# Altium schematic sheet Capture_v0.SchDoc
size A1
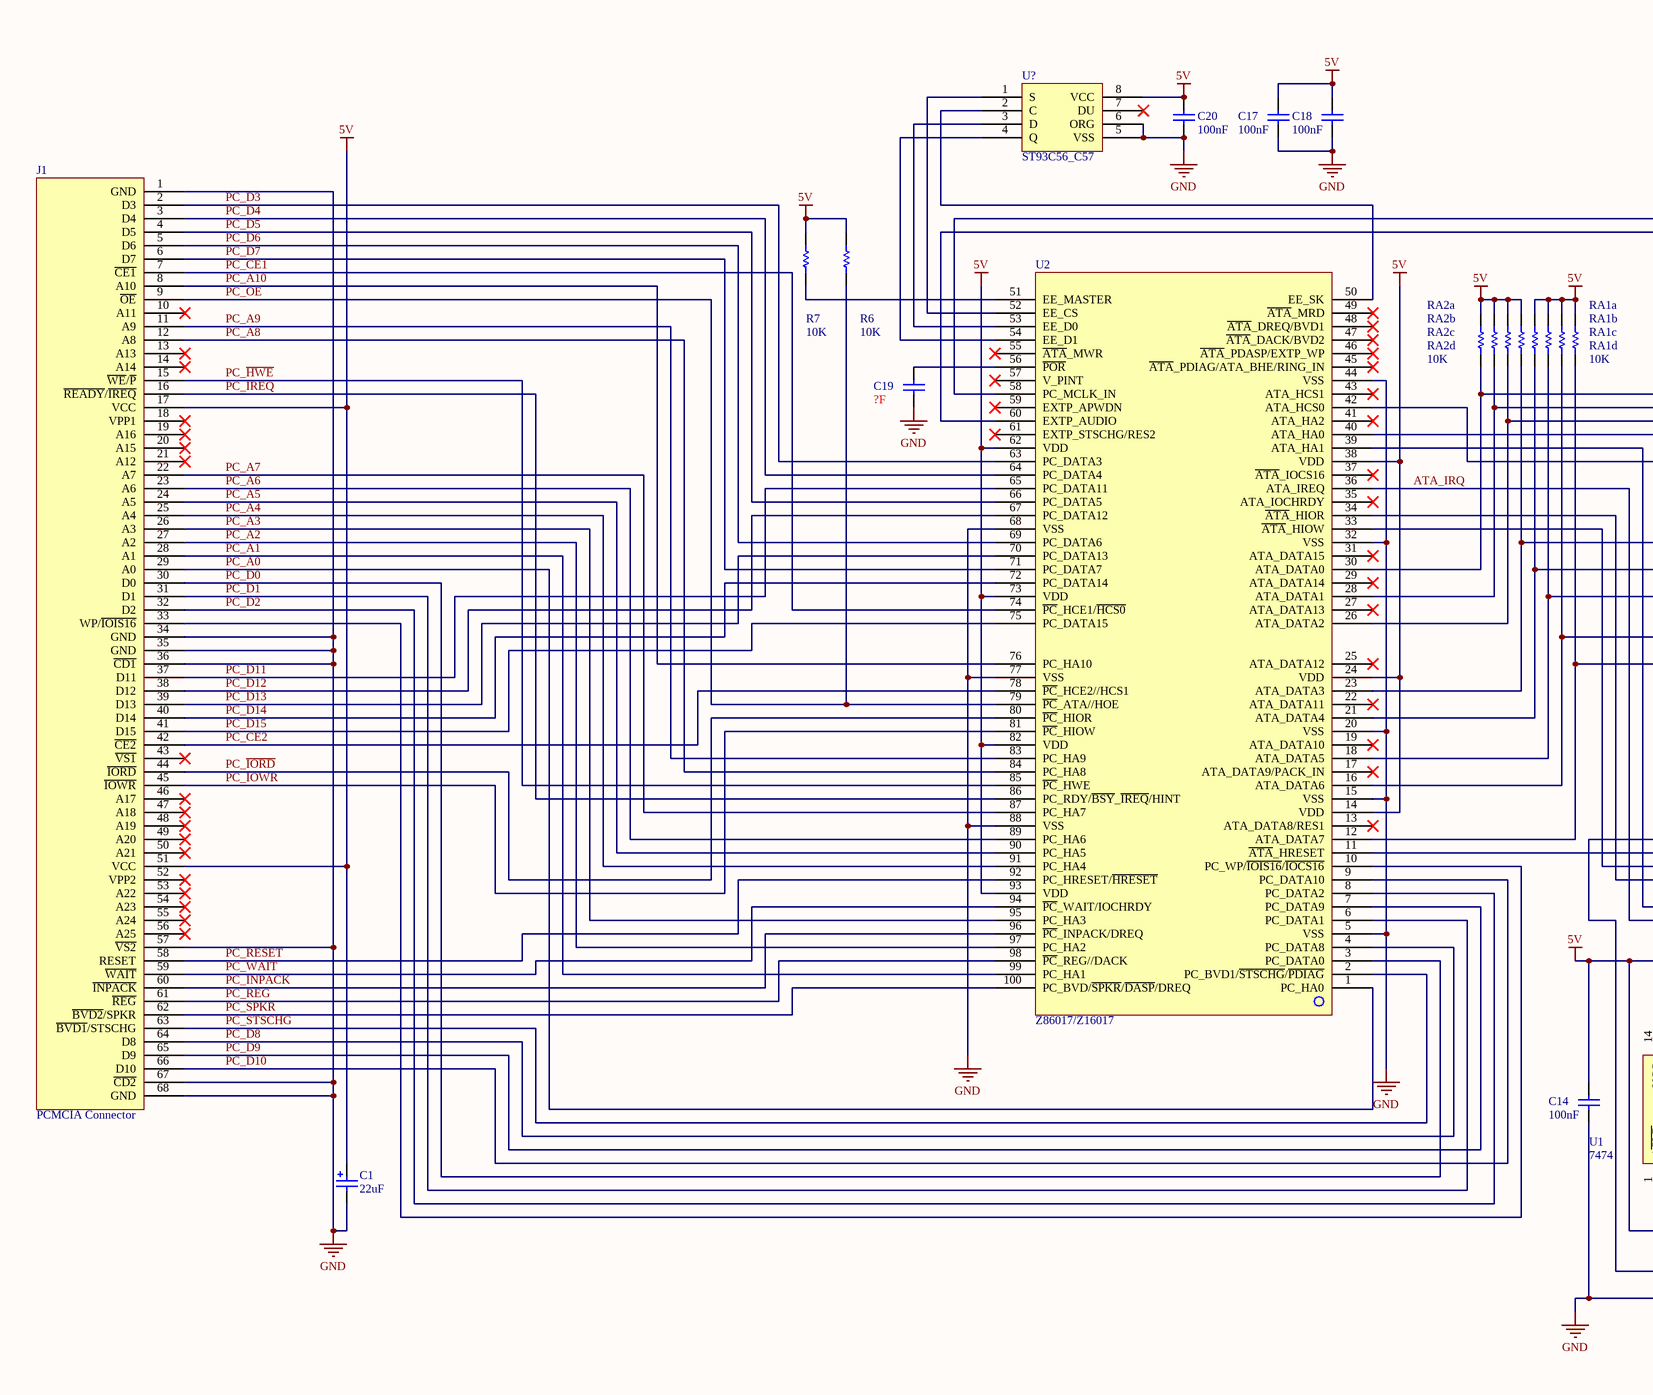
[diagram p0: Capture_v0.SchDoc, left]
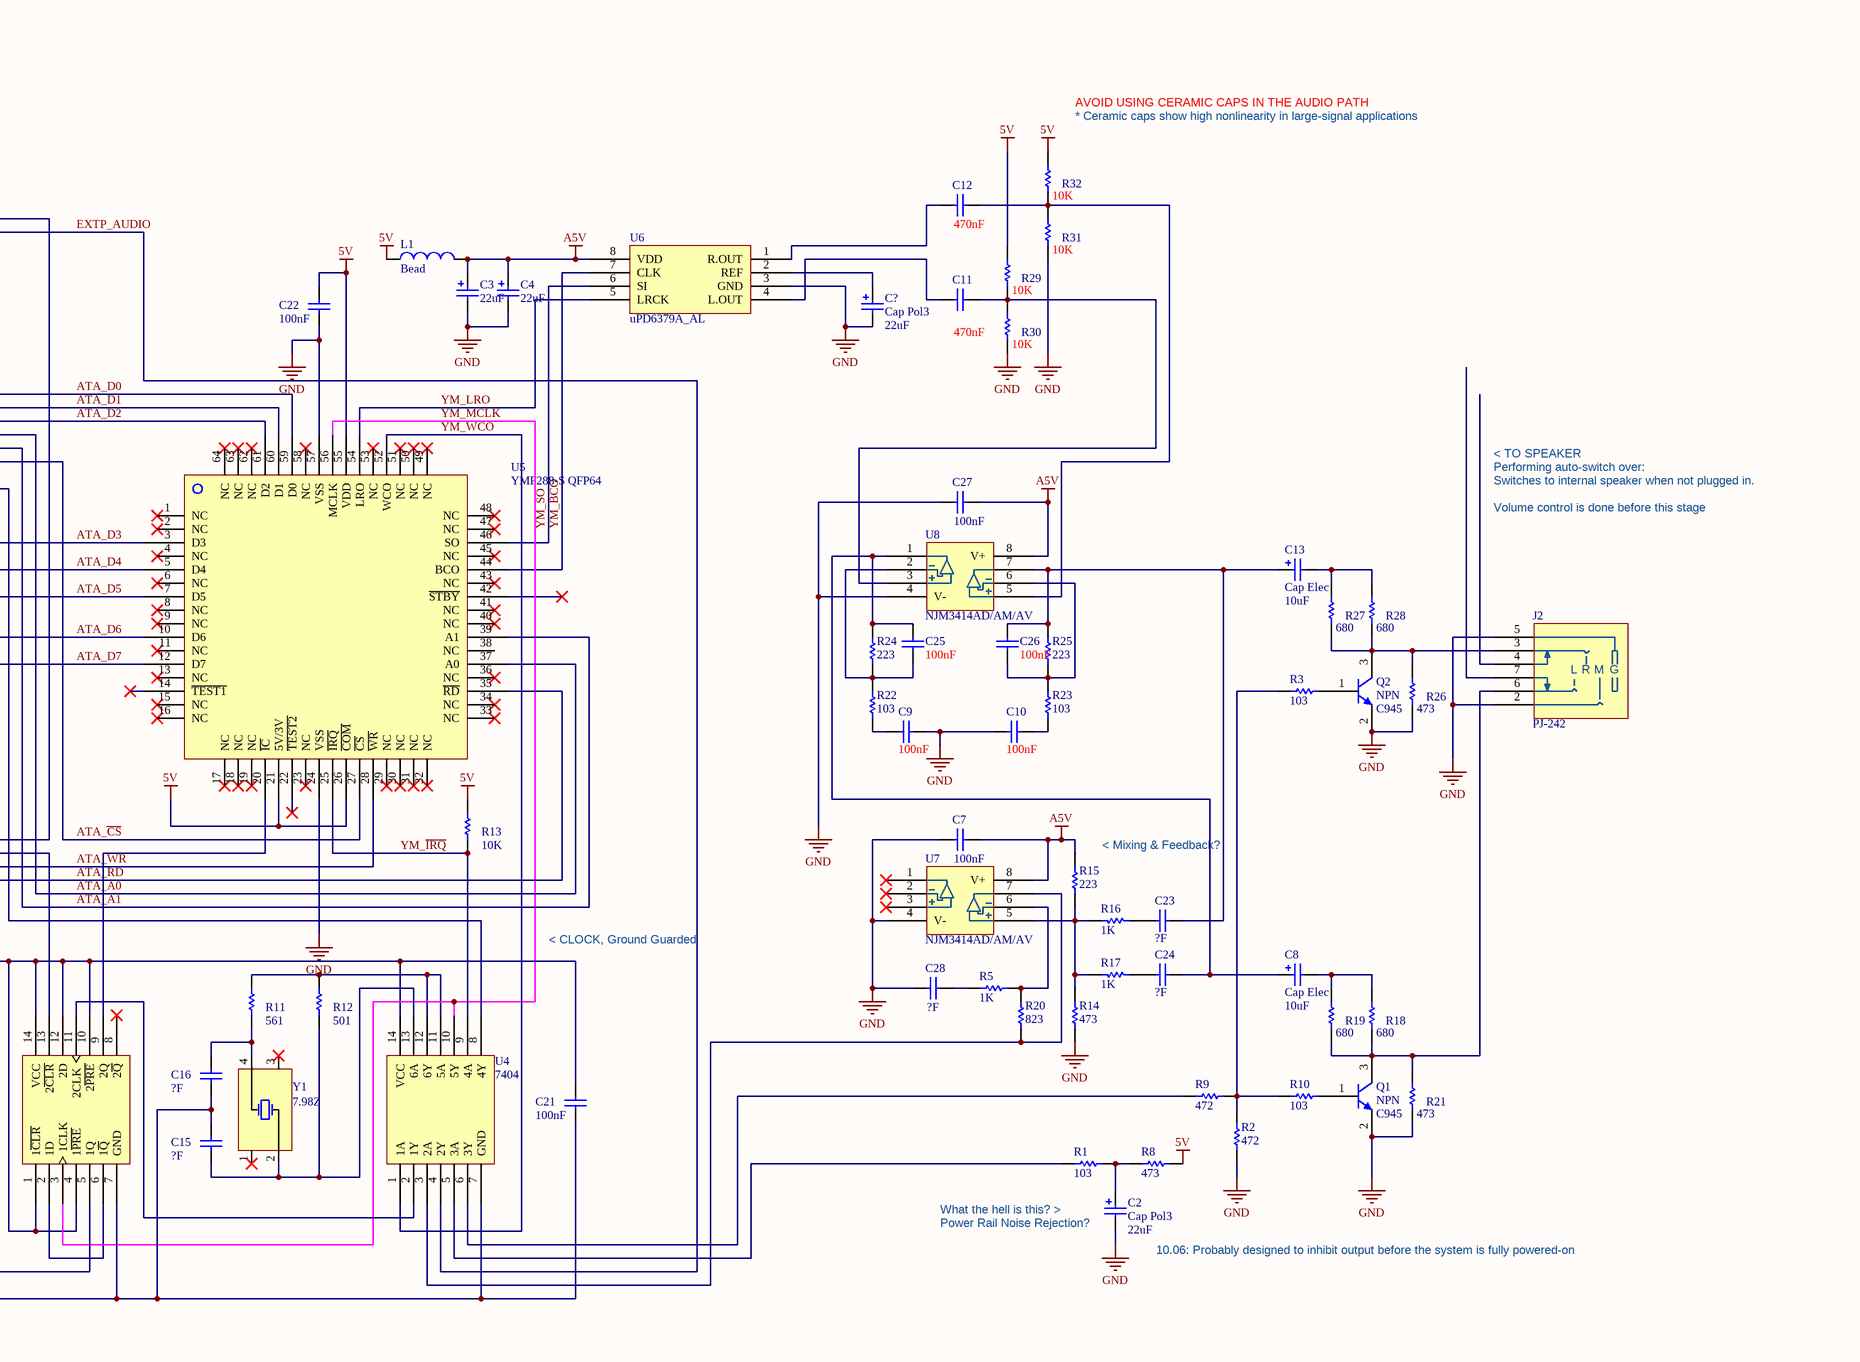
[diagram p1: Capture_v0.SchDoc, right]

## Parts
C1  value 22uF  [C2225]  (hidden comment: Cap Pol3)
C2  Cap Pol3  value 22uF  [C2225]
C3  value 22uF  [C2225]  (hidden comment: Cap Pol3)
C4  value 22uF  [C2225]  (hidden comment: Cap Pol3)
C7  value 100nF  [CEIA0603X04N]  (hidden comment: Cap)
C8  Cap Elec  value 10uF  [C-RB-4_5MM_Cutout]
C9  value 100nF  [CEIA0603X04N]  (hidden comment: Cap)
C10  value 100nF  [CEIA0603X04N]  (hidden comment: Cap)
C11  value 470nF  [CEIA0603X04N]  (hidden comment: Cap)
C12  value 470nF  [CEIA0603X04N]  (hidden comment: Cap)
C13  Cap Elec  value 10uF  [C-RB-4_5MM_Cutout]
C14  value 100nF  [CEIA0603X04N]  (hidden comment: Cap)
C15  value ?F  [CEIA0603X04N]  (hidden comment: Cap)
C16  value ?F  [CEIA0603X04N]  (hidden comment: Cap)
C17  value 100nF  [CEIA0603X04N]  (hidden comment: Cap)
C18  value 100nF  [CEIA0603X04N]  (hidden comment: Cap)
C19  value ?F  [CEIA0603X04N]  (hidden comment: Cap)
C20  value 100nF  [CEIA0603X04N]  (hidden comment: Cap)
C21  value 100nF  [CEIA0603X04N]  (hidden comment: Cap)
C22  value 100nF  [CEIA0603X04N]  (hidden comment: Cap)
C23  value ?F  [CEIA0603X04N]  (hidden comment: Cap)
C24  value ?F  [CEIA0603X04N]  (hidden comment: Cap)
C25  value 100nF  [CEIA0603X04N]  (hidden comment: Cap)
C26  value 100nF  [CEIA0603X04N]  (hidden comment: Cap)
C27  value 100nF  [CEIA0603X04N]  (hidden comment: Cap)
C28  value ?F  [CEIA0603X04N]  (hidden comment: Cap)
C?  Cap Pol3  value 22uF  [C2225]
J1  PCMCIA Connector  [TE_5146229]
J2  PJ-242  [PJ-242]
L1  Bead  [L2012X10N_LQW21]
Q1  NPN  Model: C945
Q2  NPN  Model: C945
R1  value 103  [REIA0603X04N]  (hidden comment: Res1)
R2  value 472  [REIA0603X04N]  (hidden comment: Res1)
R3  value 103  [REIA0603X04N]  (hidden comment: Res1)
R5  value 1K  [REIA0603X04N]  (hidden comment: Res1)
R6  value 10K  [REIA0603X04N]  (hidden comment: Res1)
R7  value 10K  [REIA0603X04N]  (hidden comment: Res1)
R8  value 473  [REIA0603X04N]  (hidden comment: Res1)
R9  value 472  [REIA0603X04N]  (hidden comment: Res1)
R10  value 103  [REIA0603X04N]  (hidden comment: Res1)
R11  value 561  [REIA0603X04N]  (hidden comment: Res1)
R12  value 501  [REIA0603X04N]  (hidden comment: Res1)
R13  value 10K  [REIA0603X04N]  (hidden comment: Res1)
R14  value 473  [REIA0603X04N]  (hidden comment: Res1)
R15  value 223  [REIA0603X04N]  (hidden comment: Res1)
R16  value 1K  [REIA0603X04N]  (hidden comment: Res1)
R17  value 1K  [REIA0603X04N]  (hidden comment: Res1)
R18  value 680  [REIA0603X04N]  (hidden comment: Res1)
R19  value 680  [REIA0603X04N]  (hidden comment: Res1)
R20  value 823  [REIA0603X04N]  (hidden comment: Res1)
R21  value 473  [REIA0603X04N]  (hidden comment: Res1)
R22  value 103  [REIA0603X04N]  (hidden comment: Res1)
R23  value 103  [REIA0603X04N]  (hidden comment: Res1)
R24  value 223  [REIA0603X04N]  (hidden comment: Res1)
R25  value 223  [REIA0603X04N]  (hidden comment: Res1)
R26  value 473  [REIA0603X04N]  (hidden comment: Res1)
R27  value 680  [REIA0603X04N]  (hidden comment: Res1)
R28  value 680  [REIA0603X04N]  (hidden comment: Res1)
R29  value 10K  [REIA0603X04N]  (hidden comment: Res1)
R30  value 10K  [REIA0603X04N]  (hidden comment: Res1)
R31  value 10K  [REIA0603X04N]  (hidden comment: Res1)
R32  value 10K  [REIA0603X04N]  (hidden comment: Res1)
RA1a  Res1  [REIA0603X04N]  (value not drawn)
RA1b  Res1  [REIA0603X04N]  (value not drawn)
RA1c  Res1  [REIA0603X04N]  (value not drawn)
RA1d  value 10K  [REIA0603X04N]  (hidden comment: Res1)
RA2a  value 10K  [REIA0603X04N]  (hidden comment: Res1)
RA2b  Res1  [REIA0603X04N]  (value not drawn)
RA2c  Res1  [REIA0603X04N]  (value not drawn)
RA2d  Res1  [REIA0603X04N]  (value not drawn)
U1  7474  [TSSOP14_TSOP65P640X120-14N]
U2  Z86017/Z16017  [VQFP100_TSQFP50P1600X1600X160-100N]
U4  7404  [TSSOP14_TSOP65P640X120-14N]
U5  YMF288-S QFP64  [TSQFP50P1200X1200X105-64N]
U6  uPD6379A_AL  [DMP8_SOIC127P680X175-8N]
U7  NJM3414AD/AM/AV  [DMP8_SOIC127P680X175-8N]
U8  NJM3414AD/AM/AV  [DMP8_SOIC127P680X175-8N]
U?  ST93C56_C57  [SOIC-8 NB]
Y1  7.98Z  [DFN172P250X80-4N]

## Nets
5V: C1.1 C14.2 C17.2 C18.2 C20.2 C21.2 C22.2 J1.17(VCC) J1.51(VCC) L1.2 R6.2 R7.2 R8.2 R13.2 R29.2 R32.2 RA1a.2 RA1b.2 RA1c.2 RA1d.2 RA2a.2 RA2b.2 RA2c.2 RA2d.2 U1.1(1~{CLR}) U1.4(1~{PRE}) U1.10(2~{PRE}) U1.12(2D) U1.14(VCC) U2.14(VDD) U2.24(VDD) U2.38(VDD) U2.62(VDD) U2.73(VDD) U2.82(VDD) U2.93(VDD) U4.14(VCC) U5.21(5V/3V) U5.26(~{COM}) U5.55(VDD) U?.8(VCC)
A5V: C3.1 C4.1 C7.2 C27.2 L1.1 R15.1 U6.8(VDD) U7.8(V+) U8.8(V+)
GND: C1.2 C2.2 C3.2 C4.2 C7.1 C9.1 C10.2 C14.1 C15.2 C16.1 C17.1 C18.1 C19.1 C20.1 C21.1 C22.1 C27.1 C28.1 C?.2 J1.1(GND) J1.34(GND) J1.35(GND) J1.36(~{CD1}) J1.57(~{VS2}) J1.67(~{CD2}) J1.68(GND) J2.2 J2.5 Q1.2(E) Q2.2(E) R2.1 R14.2 R21.1 R26.1 R30.1 R31.1 U1.7(GND) U2.5(VSS) U2.15(VSS) U2.20(VSS) U2.32(VSS) U2.44(VSS) U2.68(VSS) U2.77(VSS) U2.88(VSS) U4.7(GND) U5.24(VSS) U5.57(VSS) U6.3(GND) U7.4(V-) U8.4(V-) U?.5(VSS) U?.6(ORG)
ATA_A0: U2.40(ATA_HA0) U5.37(A0)
ATA_A1: U2.39(ATA_HA1) U5.39(A1)
ATA_~{CS}: U2.42(ATA_HCS0) U5.27(~{CS})
ATA_D0: RA2a.1 U2.30(ATA_DATA0) U5.59(D0)
ATA_D1: RA2b.1 U2.28(ATA_DATA1) U5.60(D1)
ATA_D2: RA2c.1 U2.26(ATA_DATA2) U5.61(D2)
ATA_D3: RA2d.1 U2.23(ATA_DATA3) U5.3(D3)
ATA_D4: RA1a.1 U2.21(ATA_DATA4) U5.5(D4)
ATA_D5: RA1b.1 U2.18(ATA_DATA5) U5.7(D5)
ATA_D6: RA1c.1 U2.16(ATA_DATA6) U5.10(D6)
ATA_D7: RA1d.1 U2.12(ATA_DATA7) U5.12(D7)
ATA_IRQ: U2.36(ATA_IREQ) U4.8(4Y)
ATA_~{RD}: U2.34(~{ATA}_HIOR) U5.35(~{RD})
ATA_~{WR}: U2.33(~{ATA}_HIOW) U5.28(~{WR})
EXTP_AUDIO: U2.60(EXTP_AUDIO) U4.4(2Y)
PC_A0: J1.29(A0) U2.1(PC_HA0)
PC_A1: J1.28(A1) U2.99(PC_HA1)
PC_A2: J1.27(A2) U2.97(PC_HA2)
PC_A3: J1.26(A3) U2.95(PC_HA3)
PC_A4: J1.25(A4) U2.91(PC_HA4)
PC_A5: J1.24(A5) U2.90(PC_HA5)
PC_A6: J1.23(A6) U2.89(PC_HA6)
PC_A7: J1.22(A7) U2.87(PC_HA7)
PC_A8: J1.12(A8) U2.84(PC_HA8)
PC_A9: J1.11(A9) U2.83(PC_HA9)
PC_A10: J1.8(A10) U2.76(PC_HA10)
PC_~{CE1}: J1.7(~{CE1}) U2.74(~{PC}_HCE1/~{HCS0})
PC_~{CE2}: J1.42(~{CE2}) U2.78(~{PC}_HCE2//HCS1)
PC_D0: J1.30(D0) U2.3(PC_DATA0)
PC_D1: J1.31(D1) U2.6(PC_DATA1)
PC_D2: J1.32(D2) U2.8(PC_DATA2)
PC_D3: J1.2(D3) U2.63(PC_DATA3)
PC_D4: J1.3(D4) U2.64(PC_DATA4)
PC_D5: J1.4(D5) U2.66(PC_DATA5)
PC_D6: J1.5(D6) U2.69(PC_DATA6)
PC_D7: J1.6(D7) U2.71(PC_DATA7)
PC_D8: J1.64(D8) U2.4(PC_DATA8)
PC_D9: J1.65(D9) U2.7(PC_DATA9)
PC_D10: J1.66(D10) U2.9(PC_DATA10)
PC_D11: J1.37(D11) U2.65(PC_DATA11)
PC_D12: J1.38(D12) U2.67(PC_DATA12)
PC_D13: J1.39(D13) U2.70(PC_DATA13)
PC_D14: J1.40(D14) U2.72(PC_DATA14)
PC_D15: J1.41(D15) U2.75(PC_DATA15)
PC_~{HWE}: J1.15(~{WE}/~{P}) U2.85(~{PC}_HWE)
PC_~{INPACK}: J1.60(~{INPACK}) U2.96(~{PC}_INPACK/DREQ)
PC_~{IORD}: J1.44(~{IORD}) U2.80(~{PC}_HIOR)
PC_~{IOWR}: J1.45(~{IOWR}) U2.81(~{PC}_HIOW)
PC_~{IREQ}: J1.16(~{READY}/~{IREQ}) U2.86(PC_RDY/~{BSY}_~{IREQ}/HINT)
PC_~{OE}: J1.9(~{OE}) R6.1 U2.79(~{PC}_ATA//HOE)
PC_~{REG}: J1.61(~{REG}) U2.98(~{PC}_REG//DACK)
PC_RESET: J1.58(RESET) U2.92(PC_HRESET/~{HRESET})
PC_SPKR: J1.62(~{BVD2}/SPKR) U2.100(PC_BVD/~{SPKR}/~{DASP}/DREQ)
PC_STSCHG: J1.63(~{BVD1}/STSCHG) U2.2(PC_BVD1/~{STSCHG}/~{PDIAG})
PC_~{WAIT}: J1.59(~{WAIT}) U2.94(~{PC}_WAIT/IOCHRDY)
YM_BCO: U5.44(BCO) U6.7(CLK)
YM_~{IRQ}: R13.1 U4.9(4A) U5.25(~{IRQ})
YM_LRO: U5.54(LRO) U6.5(LRCK)
YM_MCLK: U1.3(1CLK) U4.10(5Y) U5.56(MCLK)
YM_SO: U5.46(SO) U6.6(SI)
YM_WCO: U4.1(1A) U5.52(WCO)
NetC2_1: C2.1 R1.1 R8.1
NetC8_1: C8.1 C24.1 C25.1 R24.2 U8.1
NetC8_2: C8.2 R18.2 R19.2
NetC9_2: C9.2 R22.1
NetC10_1: C10.1 R23.1
NetC11_1: C11.1 U6.4(L.OUT)
NetC11_2: C11.2 R29.1 R30.2 U8.3
NetC12_1: C12.1 U6.1(R.OUT)
NetC12_2: C12.2 R31.2 R32.1 U8.5
NetC13_1: C13.1 C23.1 C26.1 R25.2 U8.7
NetC13_2: C13.2 R27.2 R28.2
NetC15_1: C15.1 R12.1 U4.13(6A) Y1.2(AD17)
NetC16_2: C16.2 R11.1 Y1.4(AD19)
NetC19_2: C19.2 U2.56(~{POR})
NetC23_2: C23.2 R16.2
NetC24_2: C24.2 R17.2
NetC25_2: C25.2 R22.2 R24.1 U8.2
NetC26_2: C26.2 R23.2 R25.1 U8.6
NetC28_2: C28.2 R5.2
NetC?_1: C?.1 U6.2(REF)
NetJ1_33: J1.33(WP/~{IOIS16}) U2.10(PC_WP/~{IOIS16}/~{IOCS16})
NetJ2_3: J2.3 Q2.3(C) R26.2 R27.1 R28.1
NetJ2_6: J2.6 Q1.3(C) R18.1 R19.1 R21.2
NetQ1_1: Q1.1(B) R10.2
NetQ2_1: Q2.1(B) R3.1
NetR1_2: R1.2 U4.5(3A)
NetR2_2: R2.2 R3.2 R9.2 R10.1
NetR5_1: R5.1 R20.1 U7.6
NetR7_1: R7.1 U2.51(EE_MASTER)
NetR9_1: R9.1 U4.6(3Y)
NetR11_2: R11.2 R12.2 U4.11(5A) U4.12(6Y)
NetR14_1: R14.1 R15.2 R16.1 R17.1 U7.5
NetR20_2: R20.2 U4.3(2A) U7.7
NetU1_2: U1.2(1D) U1.6(1~{Q})
NetU1_5: U1.5(1Q) U2.58(PC_MCLK_IN)
NetU1_9: U1.9(2Q) U5.20(~{IC})
NetU1_11: U1.11(2CLK) U4.2(1Y)
NetU1_13: U1.13(2~{CLR}) U2.11(~{ATA}_HRESET)
NetU2_50: U2.50(EE_SK) U?.2(C)
NetU2_52: U2.52(EE_CS) U?.1(S)
NetU2_53: U2.53(EE_D0) U?.3(D)
NetU2_54: U2.54(EE_D1) U?.4(Q)

Not connected (* = marked no-connect by the designer): J1 10(A11)* 13(A13)* 14(A14)* 18(VPP1)* 19(A16)* 20(A15)* 21(A12)* 43(~{VS1})* 46(A17)* 47(A18)* 48(A19)* 49(A20)* 50(A21)* 52(VPP2)* 53(A22)* 54(A23)* 55(A24)* 56(A25)*; J2 4 7; U1 8(2~{Q})*; U2 13(ATA_DATA8/RES1)* 17(ATA_DATA9/PACK_IN)* 19(ATA_DATA10)* 22(ATA_DATA11)* 25(ATA_DATA12)* 27(ATA_DATA13)* 29(ATA_DATA14)* 31(ATA_DATA15)* 35(ATA_IOCHRDY)* 37(~{ATA}_IOCS16)* 41(ATA_HA2)* 43(ATA_HCS1)* 45(~{ATA}_PDIAG/ATA_BHE/RING_IN)* 46(~{ATA}_PDASP/EXTP_WP)* 47(~{ATA}_DACK/BVD2)* 48(~{ATA}_DREQ/BVD1)* 49(~{ATA}_MRD)* 55(~{ATA}_MWR)* 57(V_PINT)* 59(EXTP_APWDN)* 61(EXTP_STSCHG/RES2)*; U5 1(NC)* 2(NC)* 4(NC)* 6(NC)* 8(NC)* 9(NC)* 11(NC)* 13(NC)* 14(~{TEST1})* 15(NC)* 16(NC)* 17(NC)* 18(NC)* 19(NC)* 22(~{TEST2})* 23(NC)* 29(NC)* 30(NC)* 31(NC)* 32(NC)* 33(NC)* 34(NC)* 36(NC)* 38(NC) 40(NC)* 41(NC)* 42(~{STBY})* 43(NC)* 45(NC)* 47(NC)* 48(NC)* 49(NC)* 50(NC)* 51(NC)* 53(NC)* 58(NC)* 62(NC)* 63(NC)* 64(NC)*; U7 1* 2* 3*; U? 7(DU)*; Y1 1(AD16)* 3(AD18)*

## Notes on the sheet
- AVOID USING CERAMIC CAPS IN THE AUDIO PATH
- (near R32) * Ceramic caps show high nonlinearity in large-signal applications
- < TO SPEAKER
- Performing auto-switch over:
- Switches to internal speaker when not plugged in.
- Volume control is done before this stage
- (near R15) < Mixing & Feedback?
- < CLOCK, Ground Guarded
- What the hell is this? >
- (near C2) Power Rail Noise Rejection?
- (near C2) 10.06: Probably designed to inhibit output before the system is fully powered-on
- (in symbol PJ-242) L; R; M; G

## Library data of the parts
C1-C4 C8 C13 C? = Cap Pol3: Polarized Capacitor (Surface Mount); Published: 8-Jun-2000; LatestRevisionDate: 29-May-2009; LatestRevisionNote: IPC-7351 Footprint Added.; PackageReference: C0805; Publisher: Altium Limited; PackageDescription: Chip Capacitor
C7 C9-C12 C14-C28 = Cap: Capacitor; Published: 8-Jun-2000; LatestRevisionDate: 17-Jul-2002; LatestRevisionNote: Re-released for DXP Platform.; PackageReference: RAD-0.3; Publisher: Altium Limited; PackageDescription: Radial Cap, Thru-Hole; 2 Leads; 0.3 in Pin Spacing
J1 = PCMCIA_Conn
J2 = PJ-242: 2.5mm Headphone Jack
L1 = Inductor: Code_IEC: 1005; Value: 1; Published: 8-Jun-2000; LatestRevisionDate: 29-May-2009; LatestRevisionNote: IPC-7351 Footprint Added.; PackageReference: 0402-A; Publisher: Altium Limited; PackageDescription: Chip Inductor; Code_JEITA: 0402
Q1 Q2 = NPN_SOT23: Generic NPN Transistor
R1-R3 R5-R32 RA1d RA2a = Res1: Resistor; Published: 8-Jun-2000; LatestRevisionDate: 17-Jul-2002; LatestRevisionNote: Re-released for DXP Platform.; PackageReference: AXIAL-0.3; Publisher: Altium Limited; PackageDescription: Axial Device, Thru-Hole; 2 Leads; 0.3 in Pin Spacing
RA1a RA1b RA1c RA2b RA2c RA2d = Res1: Resistor; Value: 10K; Published: 8-Jun-2000; LatestRevisionDate: 17-Jul-2002; LatestRevisionNote: Re-released for DXP Platform.; PackageReference: AXIAL-0.3; Publisher: Altium Limited; PackageDescription: Axial Device, Thru-Hole; 2 Leads; 0.3 in Pin Spacing
U1 = 7474_J_N_1: Dual D-Type Positive-Edge-Triggered Flip-Flops With Preset And Clear
U2 = ZX6017
U4 = 7404_J_N_1: Hex Inverter
U5 = YMF288_S
U6 = uPD6379A_AL: 2-CHANNEL 16-BIT D/A CONVERTER FOR AUDIO APPLICATION
U7 U8 = NJM3414AD_AM_AV_1: Single-Supply Dual High Current Operational Amplifier
U? = ST93C56_C57: 2K (128 x 16 or 256 x 8) SERIAL MICROWIRE EEPROM
Y1 = XTAL: 2520XTAL; Published: 8-Jun-2000; LatestRevisionDate: 17-Jul-2002; LatestRevisionNote: Re-released for DXP Platform.; PackageReference: R38; Publisher: Altium Limited